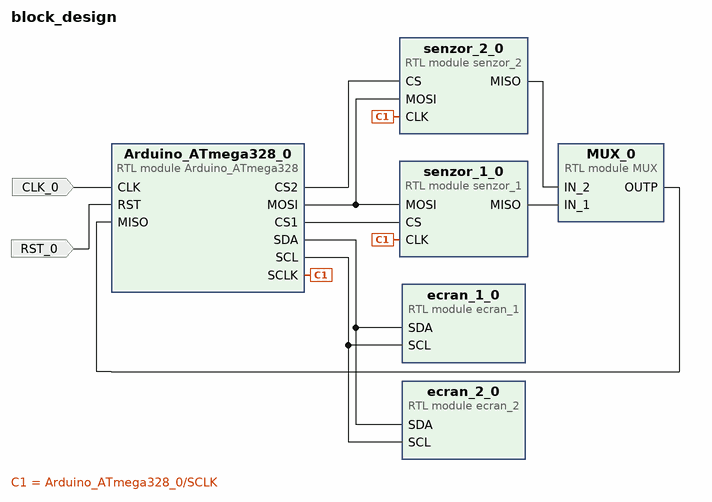
[diagram p0: block diagram of the top level]
# Vivado block design block_design, xc7z020clg484-1, Vivado 2020.1
create_bd_design block_design

create_bd_port -dir I -type clk CLK_0
create_bd_port -dir I -type rst RST_0

create_bd_cell -type module -reference MUX MUX_0
create_bd_cell -type module -reference ecran_1 ecran_1_0
create_bd_cell -type module -reference ecran_2 ecran_2_0
create_bd_cell -type module -reference senzor_2 senzor_2_0
create_bd_cell -type module -reference senzor_1 senzor_1_0
create_bd_cell -type module -reference Arduino_ATmega328 Arduino_ATmega328_0

# ---- connections ----

connect_bd_net -net microcontrolor_0_MOSI [get_bd_pins Arduino_ATmega328_0/MOSI] [get_bd_pins senzor_2_0/MOSI] [get_bd_pins senzor_1_0/MOSI]
connect_bd_net -net microcontrolor_0_SCLK [get_bd_pins Arduino_ATmega328_0/SCLK] [get_bd_pins senzor_2_0/CLK] [get_bd_pins senzor_1_0/CLK]
connect_bd_net [get_bd_pins senzor_1_0/MISO] [get_bd_pins MUX_0/IN_1]
connect_bd_net [get_bd_pins senzor_2_0/MISO] [get_bd_pins MUX_0/IN_2]
connect_bd_net -net microcontrolor_0_SDA [get_bd_pins Arduino_ATmega328_0/SDA] [get_bd_pins ecran_1_0/SDA] [get_bd_pins ecran_2_0/SDA]
connect_bd_net -net microcontrolor_0_SCL [get_bd_pins Arduino_ATmega328_0/SCL] [get_bd_pins ecran_1_0/SCL] [get_bd_pins ecran_2_0/SCL]
connect_bd_net [get_bd_pins MUX_0/OUTP] [get_bd_pins Arduino_ATmega328_0/MISO]
connect_bd_net -net CLK_0_1 [get_bd_ports CLK_0] [get_bd_pins Arduino_ATmega328_0/CLK]
connect_bd_net [get_bd_pins Arduino_ATmega328_0/CS1] [get_bd_pins senzor_1_0/CS]
connect_bd_net [get_bd_pins Arduino_ATmega328_0/CS2] [get_bd_pins senzor_2_0/CS]
connect_bd_net -net RST_0_1 [get_bd_ports RST_0] [get_bd_pins Arduino_ATmega328_0/RST]

validate_bd_design
save_bd_design
